# Altium project New_Action.PrjPcb
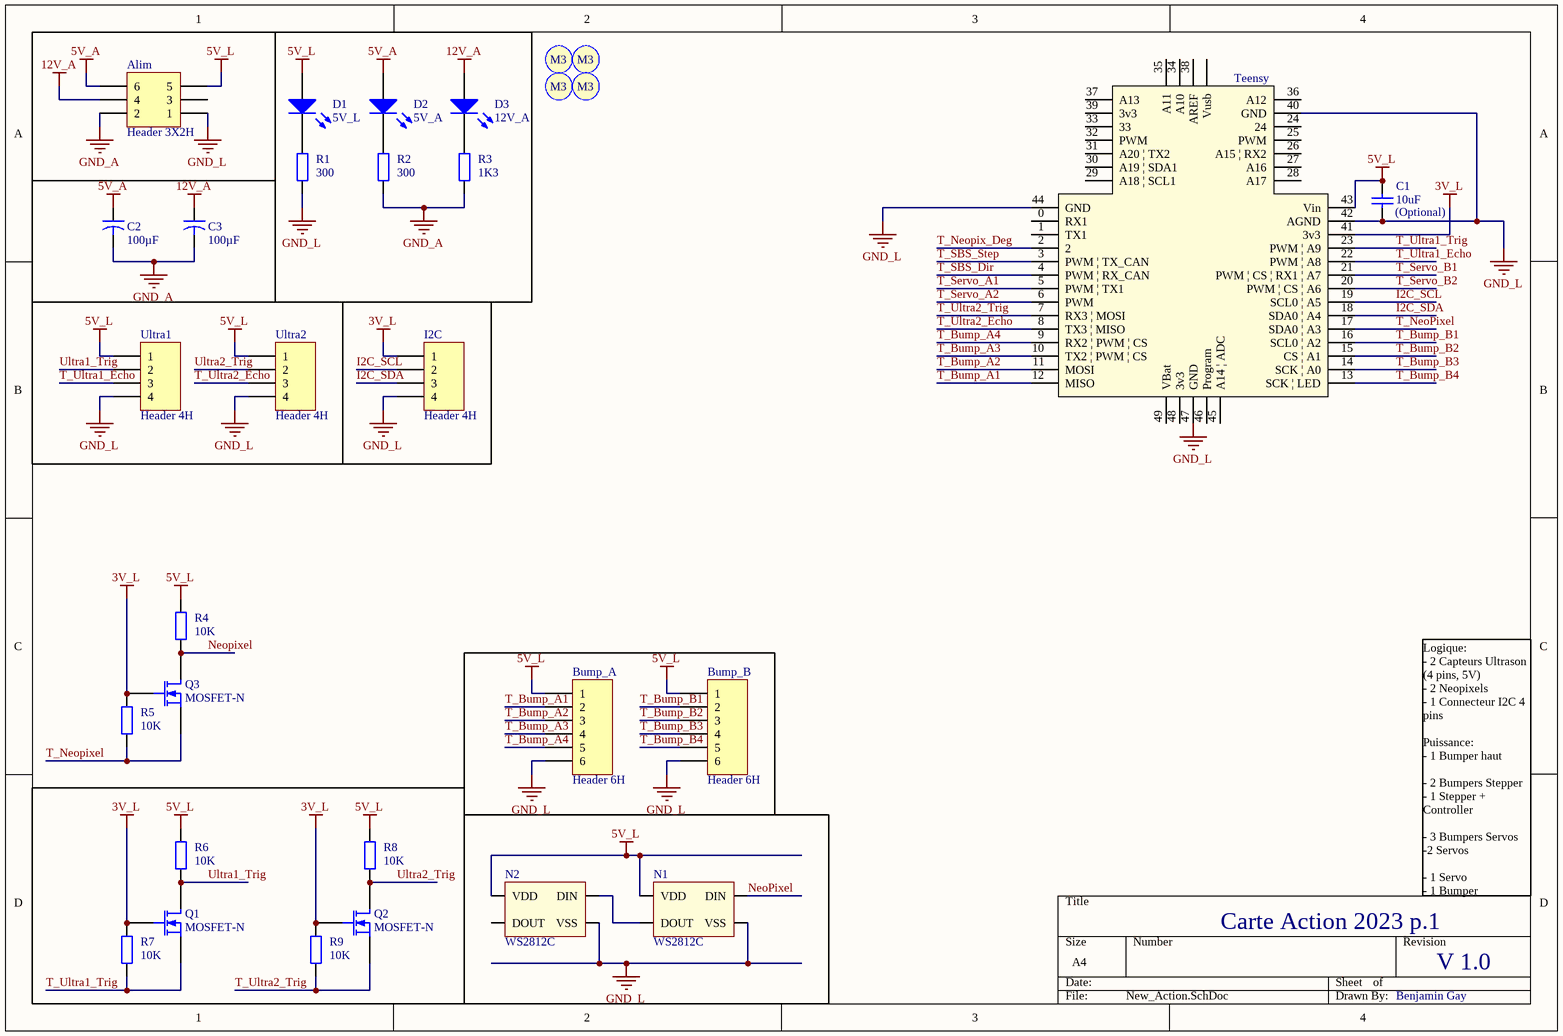
[diagram p0: New_Action.SchDoc]
1 sheet, 31 parts. Net scope: global (net labels, ports and power ports of the same name join across sheets).
Board file: New_Action.PcbDoc

## Sheet New_Action.SchDoc
size A4

### Parts
Alim  Header 3X2H  [MOLEX_MINIFITJR_3X2H]
Bump_A  Header 6H  [S6B-XH-A]
Bump_B  Header 6H  [S6B-XH-A]
C1  (Optional)  value 10uF  [Capacitor 1206]
C2  value 100µF  [Condensateur]  (hidden comment: Cap2)
C3  value 100µF  [Condensateur]  (hidden comment: Cap2)
D1  5V_L  [KP-3216SEC]
D2  5V_A  [KP-3216SEC]
D3  12V_A  [KP-3216SEC]
I2C  Header 4H  [S4B-XH-A]
N1  WS2812C  [WS2812C]
N2  WS2812C  [WS2812C]
Q1  MOSFET-N  [SOT23_M]
Q2  MOSFET-N  [SOT23_M]
Q3  MOSFET-N  [SOT23_M]
R1  value 300  [Resistor 1206]  (hidden comment: Res2)
R2  value 300  [Resistor 1206]  (hidden comment: Res2)
R3  value 1K3  [Resistor 1206]  (hidden comment: Res2)
R4  value 10K  [Resistor 1206]  (hidden comment: Res2)
R5  value 10K  [Resistor 1206]  (hidden comment: Res2)
R6  value 10K  [Resistor 1206]  (hidden comment: Res2)
R7  value 10K  [Resistor 1206]  (hidden comment: Res2)
R8  value 10K  [Resistor 1206]  (hidden comment: Res2)
R9  value 10K  [Resistor 1206]  (hidden comment: Res2)
S1  Screw M3  [Screw M3]  (value not drawn)
S2  Screw M3  [Screw M3]  (value not drawn)
S3  Screw M3  [Screw M3]  (value not drawn)
S4  Screw M3  [Screw M3]  (value not drawn)
Teensy  Teensy 3.2  [teensy]  (value not drawn)
Ultra1  Header 4H  [S4B-XH-A]
Ultra2  Header 4H  [S4B-XH-A]

### Nets
3V_L: I2C.1 Q1.2(G) Q2.2(G) Q3.2(G) R5.1 R7.1 R9.1 Teensy.41(3v3)
5V_A: Alim.6 C2.1 D2.1(A)
5V_L: Alim.5 Bump_A.1 Bump_B.1 C1.2 D1.1(A) N1.1(VDD) N2.1(VDD) R4.1 R6.1 R8.1 Teensy.43(Vin) Ultra1.1 Ultra2.1
12V_A: Alim.4 C3.1 D3.1(A)
GND_A: Alim.2 C2.2 C3.2 R2.2 R3.2
GND_L: Alim.1 Bump_A.6 Bump_B.6 C1.1 I2C.4 N1.3(VSS) N2.3(VSS) R1.1 Teensy.40(GND) Teensy.42(AGND) Teensy.44(GND) Teensy.47(GND) Ultra1.4 Ultra2.4
I2C_SCL: I2C.2 Teensy.19(SCL0_|_A5)
I2C_SDA: I2C.3 Teensy.18(SDA0_|_A4)
NeoPixel: N1.4(DIN) Q3.1(D) R4.2
T_Bump_A1: Bump_A.2 Teensy.12(MISO)
T_Bump_A2: Bump_A.3 Teensy.11(MOSI)
T_Bump_A3: Bump_A.4 Teensy.10(TX2_|_PWM_|_CS)
T_Bump_A4: Bump_A.5 Teensy.9(RX2_|_PWM_|_CS)
T_Bump_B1: Bump_B.2 Teensy.16(SCL0_|_A2)
T_Bump_B2: Bump_B.3 Teensy.15(CS_|_A1)
T_Bump_B3: Bump_B.4 Teensy.14(SCK_|_A0)
T_Bump_B4: Bump_B.5 Teensy.13(SCK_|_LED)
T_Neopix_Deg: Teensy.2
T_NeoPixel: Q3.3(S) R5.2 Teensy.17(SDA0_|_A3)
T_SBS_Dir: Teensy.4(PWM_|_RX_CAN)
T_SBS_Step: Teensy.3(PWM_|_TX_CAN)
T_Servo_A1: Teensy.5(PWM_|_TX1)
T_Servo_A2: Teensy.6(PWM)
T_Servo_B1: Teensy.21(PWM_|_CS_|_RX1_|_A7)
T_Servo_B2: Teensy.20(PWM_|_CS_|_A6)
T_Ultra1_Echo: Teensy.22(PWM_|_A8) Ultra1.3
T_Ultra1_Trig: Q1.3(S) R7.2 Teensy.23(PWM_|_A9)
T_Ultra2_Echo: Teensy.8(TX3_|_MISO) Ultra2.3
T_Ultra2_Trig: Q2.3(S) R9.2 Teensy.7(RX3_|_MOSI)
Ultra1_Trig: Q1.1(D) R6.2 Ultra1.2
Ultra2_Trig: Q2.1(D) R8.2 Ultra2.2
NetD1_2: D1.2(K) R1.2
NetD2_2: D2.2(K) R2.1
NetD3_2: D3.2(K) R3.1
NetN1_2: N1.2(DOUT) N2.4(DIN)

Not connected (* = marked no-connect by the designer): Alim 3; N2 2(DOUT); Teensy 0(RX1) 1(TX1) 24 25(PWM) 26(A15_|_RX2) 27(A16) 28(A17) 29(A18_|_SCL1) 30(A19_|_SDA1) 31(A20_|_TX2) 32(PWM) 33 34(A10) 35(A11) 36(A12) 37(A13) 38(AREF) 39(3v3) 45(A14_|_ADC) 46(Program) 48(3v3) 49(VBat) 50(Vusb)

### Notes on the sheet
- Logique:
  - 2 Capteurs Ultrason (4 pins, 5V)
  - 2 Neopixels
  - 1 Connecteur I2C 4 pins
  Puissance:
  - 1 Bumper haut
  - 2 Bumpers Stepper
  - 1 Stepper + Controller
  - 3 Bumpers Servos
  -2 Servos
  - 1 Servo
  - 1 Bumper
- Carte Action 2023 p.1
- V 1.0
- Benjamin Gay
- (in symbol Screw M3) M3

### Library data of the parts
Alim = Header 3X2H: Header, 3-Pin, Dual row, Right Angle; LatestRevisionDate: 17-Jul-2002; LatestRevisionNote: Re-released for DXP Platform.; Publisher: Altium Limited
Bump_A Bump_B = Header 6H: Header, 6-Pin, Right Angle; LatestRevisionDate: 17-Jul-2002; LatestRevisionNote: Re-released for DXP Platform.; Publisher: Altium Limited
C1 = Cap: Capacitor; Published: 8-Jun-2000; LatestRevisionDate: 17-Jul-2002; LatestRevisionNote: Re-released for DXP Platform.; PackageReference: RAD-0.3; Publisher: Altium Limited; PackageDescription: Radial Cap, Thru-Hole; 2 Leads; 0.3 in Pin Spacing
C2 C3 = Cap2: Capacitor; Published: 23-Sep-2002; PackageReference: CAPR5-4X5; Publisher: Altium Limited; PackageDescription: Capacitor; 2 Leads
D1-D3 = LED2: Typical RED, GREEN, YELLOW, AMBER GaAs LED; Published: 8-Jun-2000; LatestRevisionDate: 17-Jul-2002; LatestRevisionNote: Re-released for DXP Platform.; PackageVersion: Feb-2002; PackageReference: 3.2X1.6X1.1; Publisher: Altium Limited; PackageDescription: SM LED; 2 Flat Leads
I2C Ultra1 Ultra2 = Header 4H: Header, 4-Pin, Right Angle; LatestRevisionDate: 17-Jul-2002; LatestRevisionNote: Re-released for DXP Platform.; Publisher: Altium Limited
N1 N2 = WS2812C: Intelligent control LED
Q1-Q3 = MOSFET-N: N-Channel MOSFET; pin to pad: 2>3 3>2; Published: 8-Jun-2000; LatestRevisionDate: 17-Jul-2002; LatestRevisionNote: Re-released for DXP Platform.; PackageVersion: 1995/1996; PackageReference: E3; Publisher: Altium Limited; PackageDescription: TO, Flat Index; 3 In-Line, Axial Leads; Body Dia. 4.6mm; Lead Dia. 0.5 mm (max)
R1-R9 = Res2: Resistor; Published: 8-Jun-2000; LatestRevisionDate: 17-Jul-2002; LatestRevisionNote: Re-released for DXP Platform.; PackageReference: AXIAL-0.4; Publisher: Altium Limited; PackageDescription: Axial Device, Thru-Hole; 2 Leads; 0.4 in Pin Spacing
Teensy = teensy3.2